# Altium project Mynd_Main.PrjPcb (part 3 of 3)
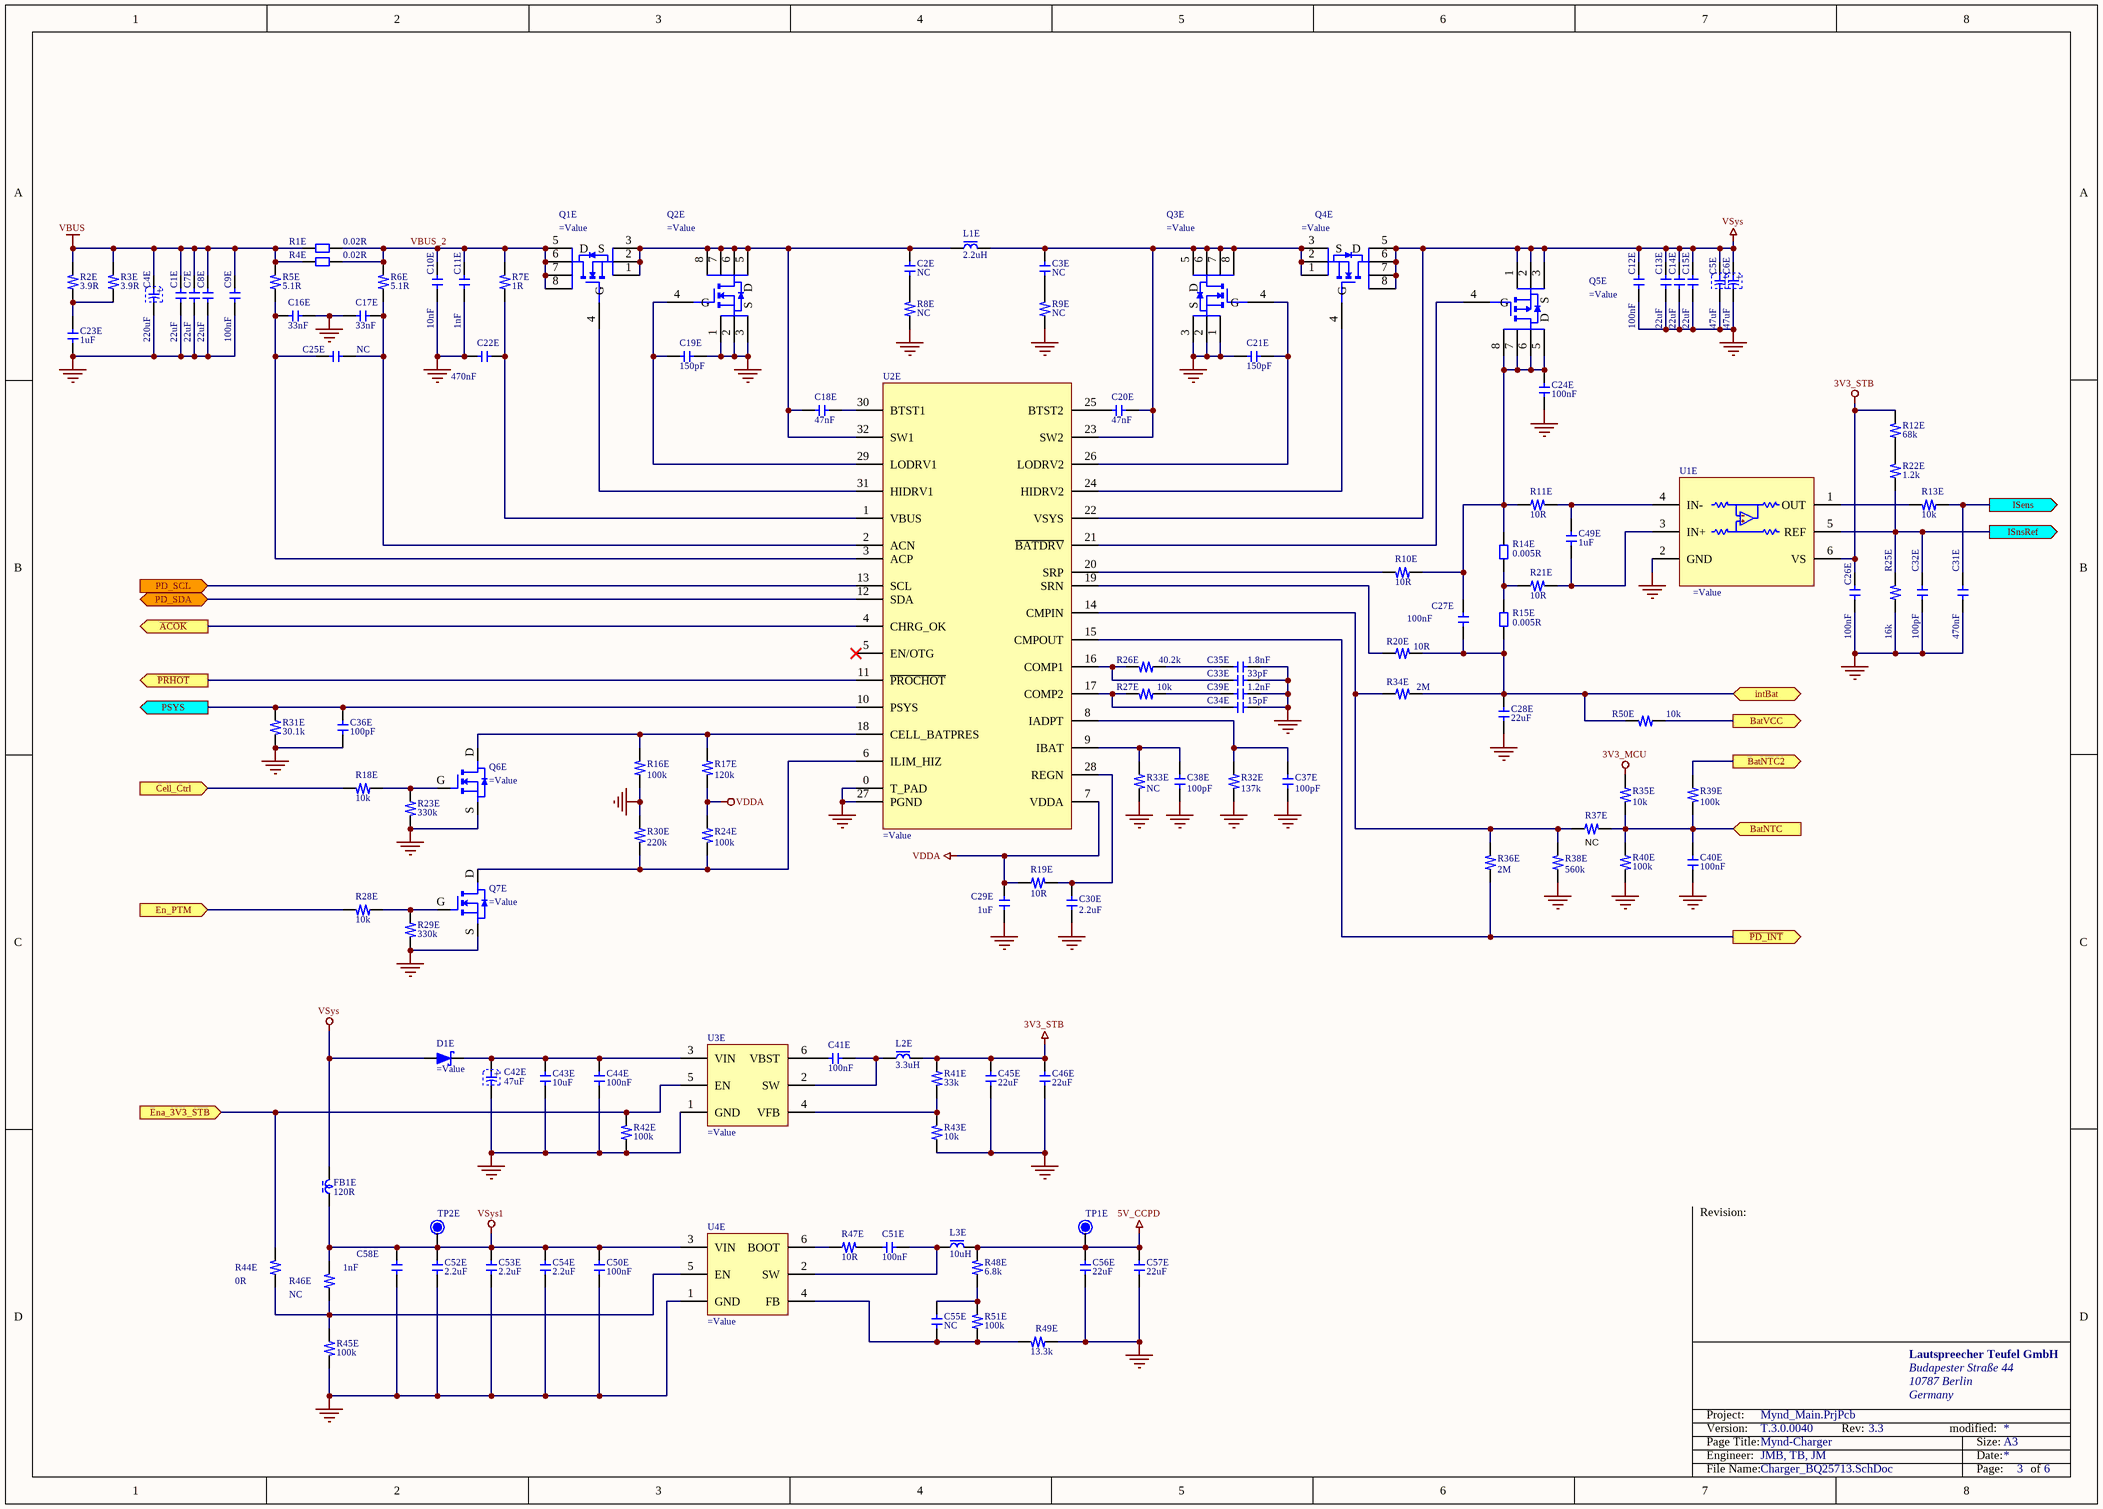
[diagram p6: Charger_BQ25713.SchDoc]

## Nets that join several sheets
3V3_MCU: USB (R20U.1), MCU (31 pins), Charger_BQ25713 (R35E.2)
3V3_STB: Mynd_Main (6 pins), USB (C4U.2 U1U.32), MCU (C30C.1 FB18C.1), Audio_Det (R20D.2), Boost_LM5123 (C34B.2 R8B.1 R35B.1 U2B.5), Charger_BQ25713 (7 pins)
5V_CCPD: Mynd_Main (P3M.23 TP38M.1), USB (5 pins), Charger_BQ25713 (5 pins)
24V: Mynd_Main (6 pins), Boost_LM5123 (20 pins)
GND: Mynd_Main (39 pins), USB (43 pins), MCU (72 pins), Audio_Det (18 pins), Boost_LM5123 (53 pins), Charger_BQ25713 (75 pins)
LDO_3V3: USB (13 pins), MCU (R13C.1)
VBUS: USB (5 pins), Charger_BQ25713 (10 pins)
VBUS_C: Mynd_Main (P4M.1 P4M.2 TP48M.1 TP49M.1), USB (10 pins)
VSys: MCU (Q1C.S R2C.2), Boost_LM5123 (7 pins), Charger_BQ25713 (16 pins)
VSys1: Mynd_Main (P3M.9 TP15M.1), Charger_BQ25713 (9 pins)
~{ACOK}: MCU (D4C.A R13C.2 R35C.1), Charger_BQ25713 (U2E.4)
~{BT_RST}: Mynd_Main (P3M.16 TP24M.1), MCU (C11C.1 ESD10C.2 FB10C.2)
~{P_Btn}: Mynd_Main (P5M.4 TP50M.1), MCU (C2C.1 ESD1C.1 FB1C.2)
~{PD_INT}: USB (R2U.1), MCU (R18C.2 U1C.55), Charger_BQ25713 (R36E.2 U2E.15)
~{Plug_Det}: Mynd_Main (P6M.1 TP62M.1), MCU (C13C.1 C18C.1 ESD12C.2 FB12C.2)
~{PRHOT}: MCU (R15C.2 U1C.6), Charger_BQ25713 (U2E.11)
~{UI_Int}: Mynd_Main (P5M.8 TP61M.1), MCU (C6C.1 ESD5C.2 FB5C.2)
~{UI_Rst}: Mynd_Main (P5M.9 TP63M.1), MCU (C8C.1 ESD7C.2 FB7C.2)
~{Amp_PDN}: Mynd_Main (P2M.24 TP46M.1), MCU (C21C.1 ESD17C.2 FB17C.2)
~{Amp_SwFlt}: Mynd_Main (P2M.12 TP30M.1), MCU (C20C.1 ESD16C.2 FB16C.2)
~{Amp_TwFlt}: Mynd_Main (P2M.22 TP44M.1), MCU (C15C.1 ESD14C.2 FB14C.2)
Amp_BCLK: Mynd_Main (P2M.18 TP41M.1), MCU (R14C.2)
Amp_DATA: Mynd_Main (P2M.16 TP37M.1), MCU (R16C.2)
Amp_LRCK: Mynd_Main (P2M.20 TP42M.1), MCU (R12C.2)
Amp_Ver: Mynd_Main (P2M.17 TP40M.1), MCU (C16C.1 ESD15C.2 FB15C.2)
BatVCC: Mynd_Main (P2M.9 TP25M.1), Charger_BQ25713 (R50E.2)
BT_BCLK: Mynd_Main (P3M.6 TP11M.1), MCU (R8C.2 R14C.1)
BT_Ctrl_Pwr: Mynd_Main (P3M.14 TP22M.1), MCU (C9C.1 ESD8C.2 FB8C.2)
BT_Ctrl_Vreg: Mynd_Main (P3M.18 TP28M.1), MCU (C7C.1 ESD6C.2 FB6C.2)
BT_DATA: Mynd_Main (P3M.4 TP10M.1), MCU (R10C.2 R16C.1)
BT_LRCK: Mynd_Main (P3M.8 TP12M.1), MCU (R6C.2 R12C.1)
BT_Ver: Mynd_Main (P3M.24 TP39M.1), MCU (C10C.1 ESD9C.2 FB9C.2)
C_Open: Mynd_Main (P1M.4 P2M.11 TP4M.1 TP29M.1), USB (D1U.A), MCU (D3C.A)
Ena_3V3_STB: MCU (D1C.3 D4C.K R40C.1), Charger_BQ25713 (R42E.1 R44E.1 U3E.5)
Env_Track: Mynd_Main (P2M.14 TP34M.1), Boost_LM5123 (R8B.2 R27B.1 U2B.2)
I2C1_SCL: USB (R7U.1 R23U.1), MCU (R9C.2 TP2C.1 U1C.58)
I2C1_SDA: USB (R10U.1 R24U.1), MCU (R11C.2 TP3C.1 U1C.59)
intBat: Mynd_Main (5 pins), MCU (Q3C.S R36C.2), Charger_BQ25713 (6 pins)
Line_L_N: Mynd_Main (P3M.15 P6M.5 TP23M.1 TP66M.1), Audio_Det (C6D.2 C22D.1)
Line_L_P: Mynd_Main (P3M.13 P6M.6 TP21M.1 TP67M.1), Audio_Det (C3D.2 C21D.1)
Line_R_N: Mynd_Main (P3M.19 P6M.3 TP31M.1 TP64M.1), Audio_Det (C13D.2 C24D.1)
Line_R_P: Mynd_Main (P3M.17 P6M.4 TP27M.1 TP65M.1), Audio_Det (C11D.2 C23D.1)
M_DET: USB (R11U.2), MCU (R28C.2)
MCU_RST: Mynd_Main (P5M.12 TP68M.1), MCU (C17C.1 R20C.1 R27C.1 U1C.7)
MCU_RX: Mynd_Main (P3M.10 TP16M.1), MCU (C3C.1 ESD2C.2 FB2C.2)
MCU_TX: Mynd_Main (P3M.12 TP18M.1), MCU (C5C.1 ESD4C.2 FB4C.2)
NetC31E_2: MCU (U1C.26), Charger_BQ25713 (C31E.2 R13E.1)
NetC32E_2: MCU (U1C.23), Charger_BQ25713 (C32E.2 R22E.1 R25E.2 U1E.5)
NetC36E_1: MCU (R30C.1), Charger_BQ25713 (C36E.1 R31E.2 U2E.10)
NetC40E_2: Mynd_Main (P1M.5 TP3M.1), Charger_BQ25713 (5 pins)
NetR18E_1: MCU (U1C.10), Charger_BQ25713 (R18E.1)
NetR22U_2: USB (R22U.2 U3U.10), MCU (U1C.22)
NetR28E_1: MCU (U1C.57), Charger_BQ25713 (R28E.1)
NetR29U_2: USB (R29U.2 U4U.10), MCU (U1C.51)
NetR39E_2: MCU (U1C.24), Charger_BQ25713 (R39E.2)
PD_SCL: USB (5 pins), Charger_BQ25713 (U2E.13)
PD_SDA: USB (5 pins), Charger_BQ25713 (U2E.12)
SCL: Mynd_Main (6 pins), MCU (C12C.1 C19C.1 ESD11C.2 FB11C.2)
SDA: Mynd_Main (6 pins), MCU (C14C.1 C36C.1 ESD13C.2 FB13C.2)
StepUp_Ena: MCU (U1C.61), Boost_LM5123 (R22B.1)
UART2_RX: USB (U4U.5), MCU (P1C.3 R34C.2 TP7C.1 U1C.17)
UART2_TX: USB (U4U.4), MCU (P1C.2 R33C.2 TP8C.1 U1C.16)
USB-CC1: Mynd_Main (P4M.7 TP57M.1), USB (C10U.1 C16U.1 U1U.24)
USB-CC2: Mynd_Main (P4M.8 TP58M.1), USB (C12U.1 C17U.1 U1U.25)
USB_B_N: Mynd_Main (P3M.20 TP32M.1), USB (U3U.5)
USB_B_P: Mynd_Main (P3M.22 TP36M.1), USB (U3U.4)
USB_J_N: Mynd_Main (P4M.6 TP55M.1), USB (L1U.2 R25U.1)
USB_J_P: Mynd_Main (P4M.5 TP54M.1), USB (L1U.1 R26U.1)
USB_M_N: USB (U3U.7), MCU (U1C.44)
USB_M_P: USB (U3U.6), MCU (U1C.45)
USB_SBU1: Mynd_Main (P4M.9 TP69M.1), USB (R35U.2 R37U.2 R39U.1 R41U.2)
USB_SBU2: Mynd_Main (P4M.10 TP60M.1), USB (R36U.2 R38U.1 R40U.1 R42U.2)

## Assembly variants
Variant-of-NotFitted-Project: not fitted C2E C3E C25E C55E R6C R8C R8E R8U R9E R9U R10C R11U R14U R15U R21B R23U R24U R27B R28C R33E R33E R37E R46E